# EAGLE design L6983 Regulator Board (EAGLE 9.6.1)
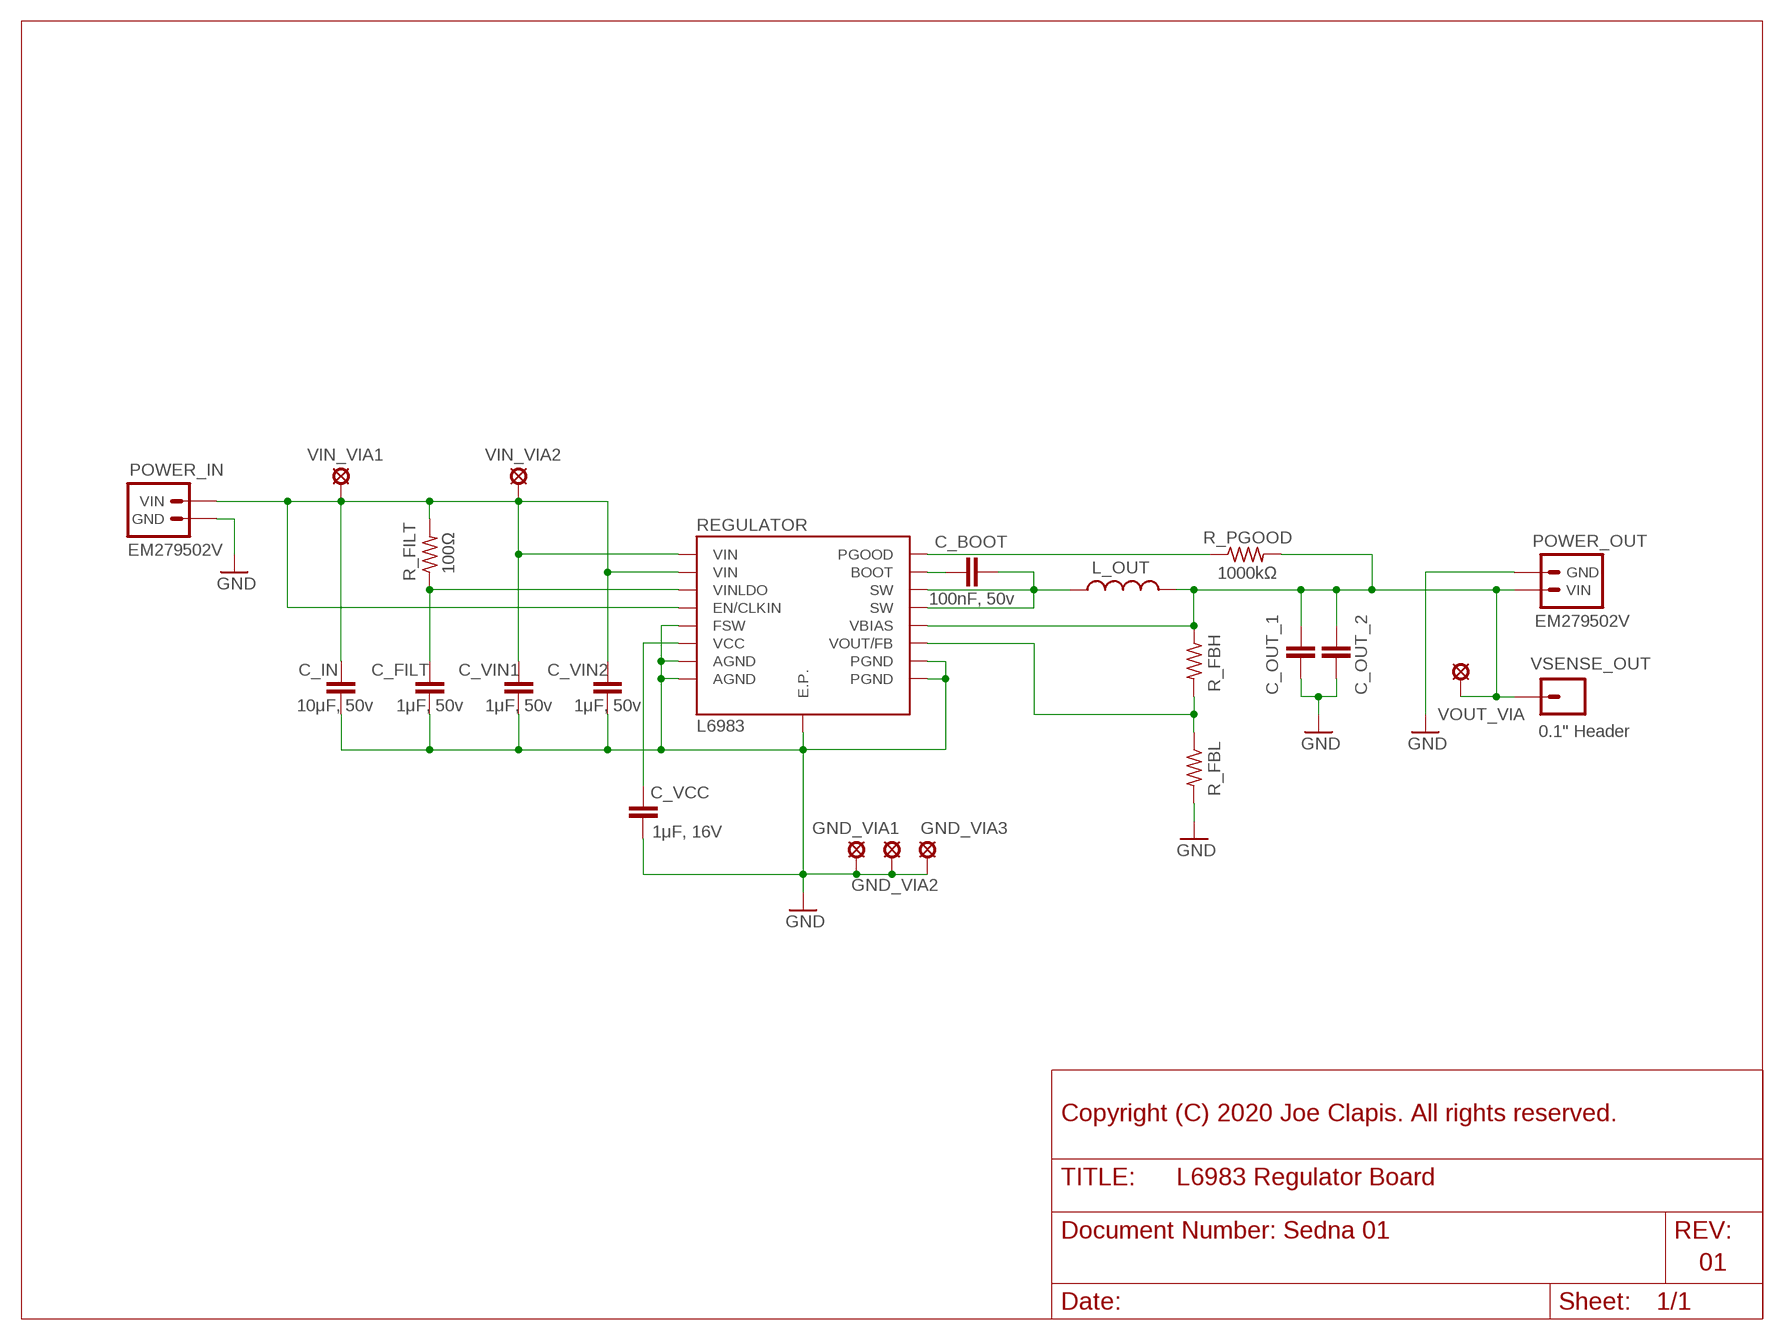
[diagram p0: schematic, sheet 1]

## Parts
C_BOOT  100nF, 50v  C-EUC0805  [C0805]
C_FILT  1μF, 50v  C-EUC0805  [C0805]
C_IN  10μF, 50v  C-EUC1206  [C1206]
C_OUT_1  TDK_C2220_5750  [TDK_C2220_5750]
C_OUT_2  TDK_C2220_5750  [TDK_C2220_5750]
C_VCC  1μF, 16V  C-EUC0805  [C0805]
C_VIN1  1μF, 50v  C-EUC0805  [C0805]
C_VIN2  1μF, 50v  C-EUC0805  [C0805]
GND_VIA1  LSP13  [LSP13]
GND_VIA2  LSP13  [LSP13]
GND_VIA3  LSP13  [LSP13]
L_OUT  PA4343_FP2  [PA4343_FP2]
POWER_IN  EM279502V  [EM279502V]
POWER_OUT  EM279502V  [EM279502V]
R_FBH  R-US_R0805  [R0805]
R_FBL  R-US_R0805  [R0805]
R_FILT  100Ω  R-US_R0805  [R0805]
R_PGOOD  1000kΩ  R-US_R0805  [R0805]
REGULATOR  L6983  [L6983]
VIN_VIA1  LSP13  [LSP13]
VIN_VIA2  LSP13  [LSP13]
VOUT_VIA  LSP13  [LSP13]
VSENSE_OUT  0.1" Header  M01PTH  [1X01]

## Nets
C_BOOT: C_BOOT.1 REGULATOR.11_BOOT(BOOT)
FB: R_FBH.2 R_FBL.1 REGULATOR.7_FB/VOUT(VOUT/FB)
GND: C_FILT.2 C_IN.2 C_OUT_1.2 C_OUT_2.2 C_VCC.2 C_VIN1.2 C_VIN2.2 GND_VIA1.MP GND_VIA2.MP GND_VIA3.MP POWER_IN.2A(GND) POWER_IN.2B(GND) POWER_OUT.2A(GND) POWER_OUT.2B(GND) R_FBL.2 REGULATOR.3_AGND(AGND) REGULATOR.8_FSW(FSW) REGULATOR.10_AGND(AGND) REGULATOR.13_PGND(PGND) REGULATOR.16_PGND(PGND) REGULATOR.E.P.
PGOOD_OUT: R_PGOOD.1 REGULATOR.5_PGOOD(PGOOD)
SW_OUT: C_BOOT.2 L_OUT.1 REGULATOR.14_SW(SW) REGULATOR.15_SW(SW)
V_IN: C_IN.1 C_VIN1.1 C_VIN2.1 POWER_IN.1A(VIN) POWER_IN.1B(VIN) R_FILT.2 REGULATOR.1_VIN(VIN) REGULATOR.4_EN/CLKIN(EN/CLKIN) REGULATOR.12_VIN(VIN) VIN_VIA1.MP VIN_VIA2.MP
V_OUT: C_OUT_1.1 C_OUT_2.1 L_OUT.2 POWER_OUT.1A(VIN) POWER_OUT.1B(VIN) R_FBH.1 R_PGOOD.2 REGULATOR.6_VBIAS(VBIAS) VOUT_VIA.MP VSENSE_OUT.1
VCC: C_VCC.1 REGULATOR.9_VCC(VCC)
VINLDO: C_FILT.1 R_FILT.1 REGULATOR.2_VINLDO(VINLDO)

## Notes on the sheet
- Copyright (C) 2020 Joe Clapis. All rights reserved.
- Sedna 01
- 01

## Library data of the parts
C_BOOT C_FILT C_IN C_VCC C_VIN1 C_VIN2 = rcl:C-EU: CAPACITOR, European symbol; SPICEPREFIX: C
C_OUT_1 C_OUT_2 = Sedna Components:TDK_C2220_5750
GND_VIA1-GND_VIA3 VIN_VIA1 VIN_VIA2 VOUT_VIA = solpad:LSP13: SOLDER PAD drill 1.3 mm, distributor Buerklin, 12H562
L_OUT = Sedna Components:PA4343_FP2: The Pulse PA4343.XXXNLT is a series of shielded SMT power inductors: https://www.mouser.com/datasheet/2/336/P770-1526930.pdf
POWER_IN POWER_OUT = Sedna Components:EM279502V
R_FBH R_FBL R_FILT R_PGOOD = rcl:R-US_: RESISTOR, American symbol; SPICEPREFIX: R
REGULATOR = Sedna Components:L6983: The L6983 is a configurable DC-DC step-down regulator, bringing 3.5-38V down to 0.85-Vin. It supports up to 3A of output current, and comes in a QFN16 package. https://my.st.com/resource/en/datasheet/l6983.pdf
VSENSE_OUT = SparkFun-Connectors:M01: Header 1 Standard 1-pin 0.1" header. Use with straight break away headers (SKU : PRT-00116), right angle break away headers (PRT-00553), swiss pins (PRT-00743), machine pins (PRT-00117), and female headers (PRT-00115). SMTSO-256-ET is a "flush mount" nut for a 4-40 screw. The older package used to be too tight, and did not allow it to sit properly thru the drill hit. The latest (0.165DIA) fits nice and snug.

## Board
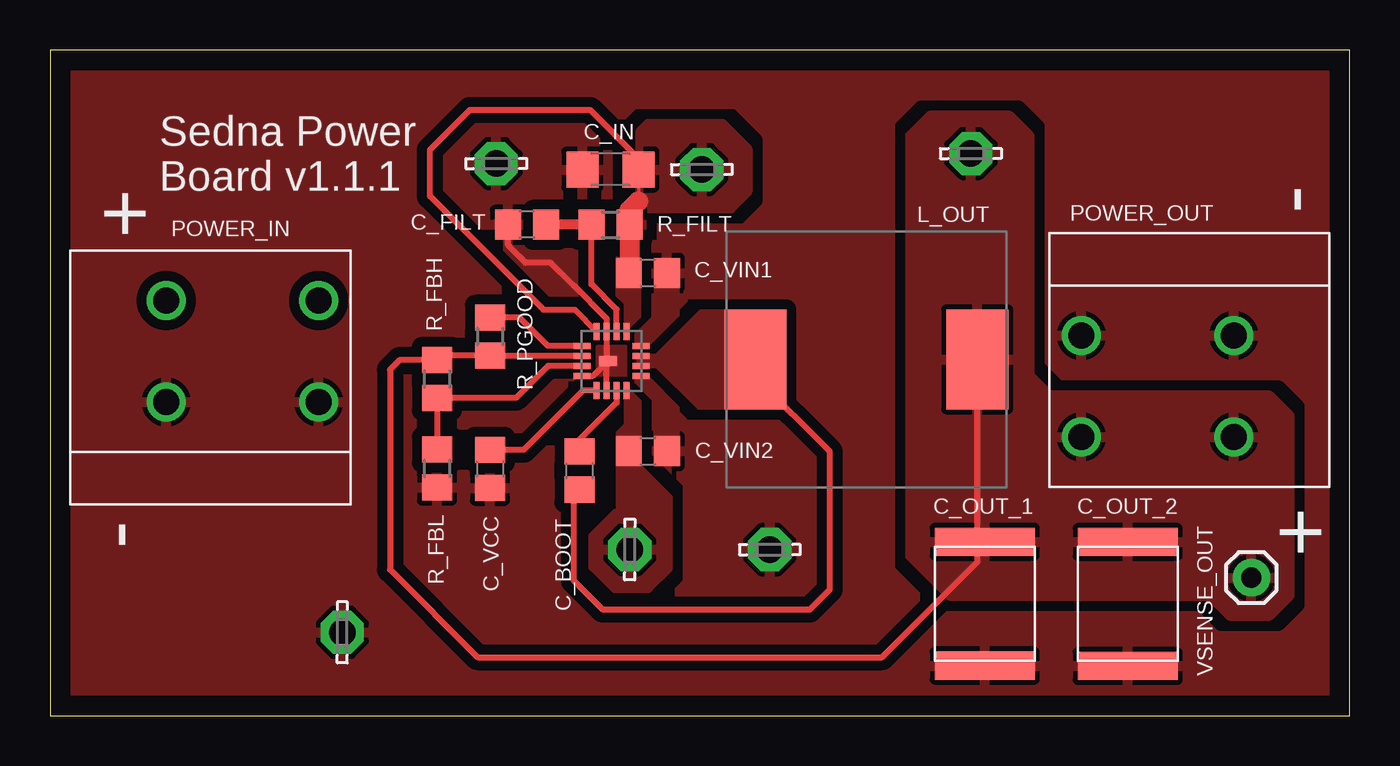
[diagram p1: board, top side]
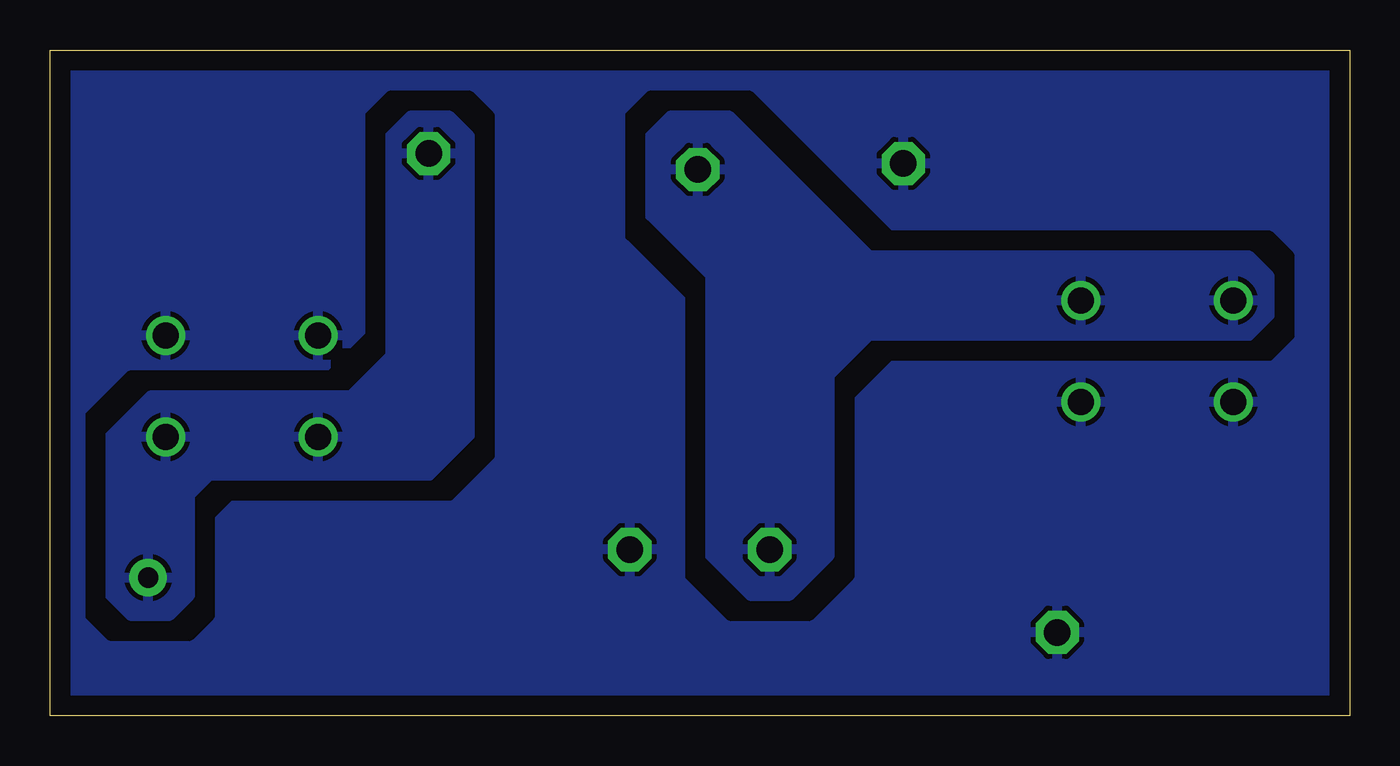
[diagram p2: board, bottom side, seen from below]

Size 65 x 33.3 mm. Coordinates in mm from the lower left corner, seen from the top.
Outline: 0,33.3 0,0 65,0 65,33.3 0,33.3
Copper layers (1*16): Top 0.035mm / dielectric 1.5mm / Bottom 0.035mm
Design rules "default": minimum track width 6mil, minimum drill 0.35mm, track to track 6mil, track to pad 6mil, pad to pad 6mil, via to via 6mil, smd to smd 6mil, copper to edge 40mil, drill to drill 6mil, minimum pad ring 10mil, minimum via ring 8mil, stop-mask expansion 4mil, vias tented up to drill 0mil, thermal gap 10mil

### Footprints (pad centres in the part's own frame; a part is rotated, then mirrored left to right if it is on the bottom)
C0805 = smd 1.3 x 1.5: 1 -0.95,0; 2 0.95,0
C1206 = smd 1.6 x 1.8: 1 -1.4,0; 2 1.4,0
TDK_C2220_5750 = smd 1.4 x 5: 1 -3.1,0; 2 3.1,0
LSP13 = drill 1.321 pad 2.159 octagon: MP 0,0
PA4343_FP2 = smd 5 x 3.1: 1 0,5.55; 2 0,-5.55
EM279502V = drill 1.3: 1A -2.54,-3.81; 1B -2.54,3.81; 2A 2.54,-3.81; 2B 2.54,3.81
R0805 = smd 1.3 x 1.5: 1 -0.95,0; 2 0.95,0
L6983 = smd 0.85 x 0.3: 1_VIN 1.475,-0.75; 2_VINLDO 1.475,-0.25; 3_AGND 1.475,0.25; 4_EN/CLKIN 1.475,0.75; 9_VCC -1.475,0.75; 10_AGND -1.475,0.25; 11_BOOT -1.475,-0.25; 12_VIN -1.475,-0.75 | smd 0.3 x 0.85: 5_PGOOD 0.75,1.475; 6_VBIAS 0.25,1.475; 7_FB/VOUT -0.25,1.475; 8_FSW -0.75,1.475; 13_PGND -0.75,-1.475; 14_SW -0.25,-1.475; 15_SW 0.25,-1.475; 16_PGND 0.75,-1.475 | smd 0.5 x 0.9: E.P. 0,0.17
1X01 = drill 1.016 pad 1.88: 1 0,0

### Placement (x,y rotation side)
C_BOOT  26.48,12.25 270 top
C_FILT  23.85,24.56 180 top
C_IN  28.03,27.32 180 top
C_OUT_1  46.75,5.6 270 top
C_OUT_2  53.91,5.58 270 top
C_VCC  22.01,12.34 270 top
C_VIN1  29.9,22.15 0 top
C_VIN2  29.9,13.23 0 top
GND_VIA1  14.62,4.16 270 top
GND_VIA2  22.32,27.62 0 top
GND_VIA3  36,8.3 0 top
L_OUT  40.83,17.82 90 top
POWER_IN  9.62,18.23 270 top
POWER_OUT  55.4,16.48 90 top
R_FBH  19.36,16.84 270 top
R_FBL  19.36,12.36 270 top
R_FILT  28.03,24.56 0 top
R_PGOOD  22.01,18.96 270 top
REGULATOR  28.09,17.74 90 top
VIN_VIA1  32.6,27.32 0 top
VIN_VIA2  29,8.3 270 top
VOUT_VIA  46.06,28.12 0 top
VSENSE_OUT  60.09,6.9 180 top

### Tracks (layer width: path | path; a pad name or v marks a point on that pad's centre or on a via)
C_BOOT
  Top 0.2: 26.48,13.8 C_BOOT.1
  Top 0.3: REGULATOR.11_BOOT 28.34,15.66 26.48,13.8
FB
  Top 0.3: REGULATOR.7_FB/VOUT 24.91,17.49 23.31,15.89 R_FBH.2 R_FBL.1
GND
  Top 0.152: 26.36,21.34 26.2,21.5
  Top 0.3: 27.74,17.56 REGULATOR.E.P. 27.84,17.82 REGULATOR.3_AGND 27.84,19.86 26.2,21.5 25.04,22.66 23.78,22.66 22.9,23.54 C_FILT.2 | REGULATOR.10_AGND 27.84,17.46 27.74,17.56 | 27.74,17.56 27.73,17.57 27.15,16.99 REGULATOR.8_FSW
  pour Top (no thermals): 28.84,18.48 27.34,18.48 27.34,17 28.84,17
  pour Bottom (isolate 1, rank 2): 0.78,0.82 64.16,0.82 64.16,32.28 0.78,32.28
  pour Top (isolate 0.5, rank 2): 64.28,32.52 0.8,32.52 0.8,1.14 64.28,1.14
  pour Top (no thermals): 29.28,18.6 29.28,19.08 30.26,20.06 30.26,22.86 30.28,22.84 31.44,22.84 31.44,20 29.94,18.5 29.38,18.5
  pour Top (no thermals): 29.26,16.98 29.26,16.68 30.22,15.72 30.22,12.52 31.46,12.52 31.46,15.42 29.9,16.98
PGOOD_OUT
  Top 0.3: REGULATOR.5_PGOOD 24.91,18.49 23.49,19.91 R_PGOOD.1
SW_OUT
  Top 0.2: C_BOOT.2 26.2,11.02 | 35.28,16.92 L_OUT.1
  Top 0.3: 26.2,11.02 26.2,6.74 27.64,5.3 38,5.3 39,6.3 39,13.2 35.28,16.92
  pour Top (no thermals): 29.36,18.06 29.36,17.44 30.32,17.44 32.4,15.36 33.96,15.36 33.96,20.26 32.5,20.26 30.28,18.04 29.38,18.04
  pour Top: 33.96,20.26 32.5,20.26 30.28,18.04 29.38,18.04 29.36,18.06 29.36,17.44 30.32,17.44 32.4,15.36 33.96,15.36
V_IN
  Top 0.152: 29.43,27.87 C_IN.1 29.43,25.73 | 28.98,25.28 R_FILT.2
  Top 0.3: 29.43,27.87 27,30.3 21,30.3 19,28.3 19,25.98 24.68,20.3 26.25,20.3 REGULATOR.4_EN/CLKIN
  Top 1: R_FILT.2 28.98,22.18 C_VIN1.1 | 28.98,25.28 29.43,25.73
  pour Top (no thermals): 28.32,22.88 28.32,21.02 28.74,20.6 28.74,19.36 28.94,19.36 29.54,19.96 29.54,22.88
  pour Top (no thermals): 28.74,16.34 28.74,14.56 28.34,14.16 28.34,9.66 31.1,9.66 31.1,10.96 29.56,12.5 29.56,15.74 28.96,16.34
  pour Top: 28.3,10.1 27.16,8.96 27.16,7.46 28.24,6.38 29.92,6.38 30.9,7.36 30.9,10.1
  pour Top: 29.54,22.76 29.54,29.24 29.9,29.6 33.64,29.6 34.88,28.36 34.88,26.2 34.04,25.36 29.58,25.36 29.58,22.78 29.56,22.76
  pour Top: 29.54,22.88 28.32,22.88 28.32,21.02 28.74,20.6 28.74,19.36 28.94,19.36 29.54,19.96
  pour Bottom: 4,22 5,23 24,23 30,29 31,30 34,30 35,29 35,25 32,22 32,8 30,6 28,6 26,8 26,17 24,19 5,19 4,20
V_OUT
  Top 0.3: REGULATOR.6_VBIAS 22.03,17.99 R_PGOOD.2 19.58,18.01 R_FBH.1 17.49,17.79 17,17.3 17,7.3 21.38,2.92 41.62,2.92 46.38,7.68 L_OUT.2
  pour Top: 43,29 43,8 45,6 58,6 59,5 61,5 62,6 62,15 61,16 50,16 49,17 49,29 48,30 44,30
  pour Bottom: 48,29 48,18 50,16 60,16 62,14 62,6 61,5 59,5 58,6 58,11 57,12 46,12 44,14 44,29 45,30 47,30
VCC
  Top 0.3: REGULATOR.9_VCC 26.66,16.27 23.69,13.29 C_VCC.1
VINLDO
  Top 0.3: REGULATOR.2_VINLDO 28.34,20.32 27.08,21.57 R_FILT.1
  Top 0.5: R_FILT.1 C_FILT.1

### Text on the board
tNames: - | + | Sedna Power / Board v1.1.1 | - | +